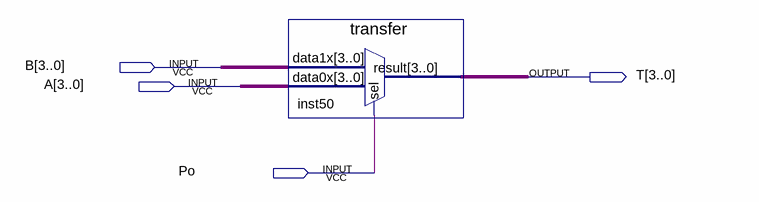
[diagram p0: schematic sheet]
// Quartus schematic TransferUnitl.bdf as structural Verilog: 1 symbols, 4 pins
module TransferUnitl (
  input  [3:0] B,
  input  [3:0] A,
  input  Po,
  output [3:0] T
);

  transfer inst50 (.data1x(B), .data0x(A), .sel(Po), .result(T));
endmodule
